# Altium schematic sheet Buttons and Switches.SchDoc
size B
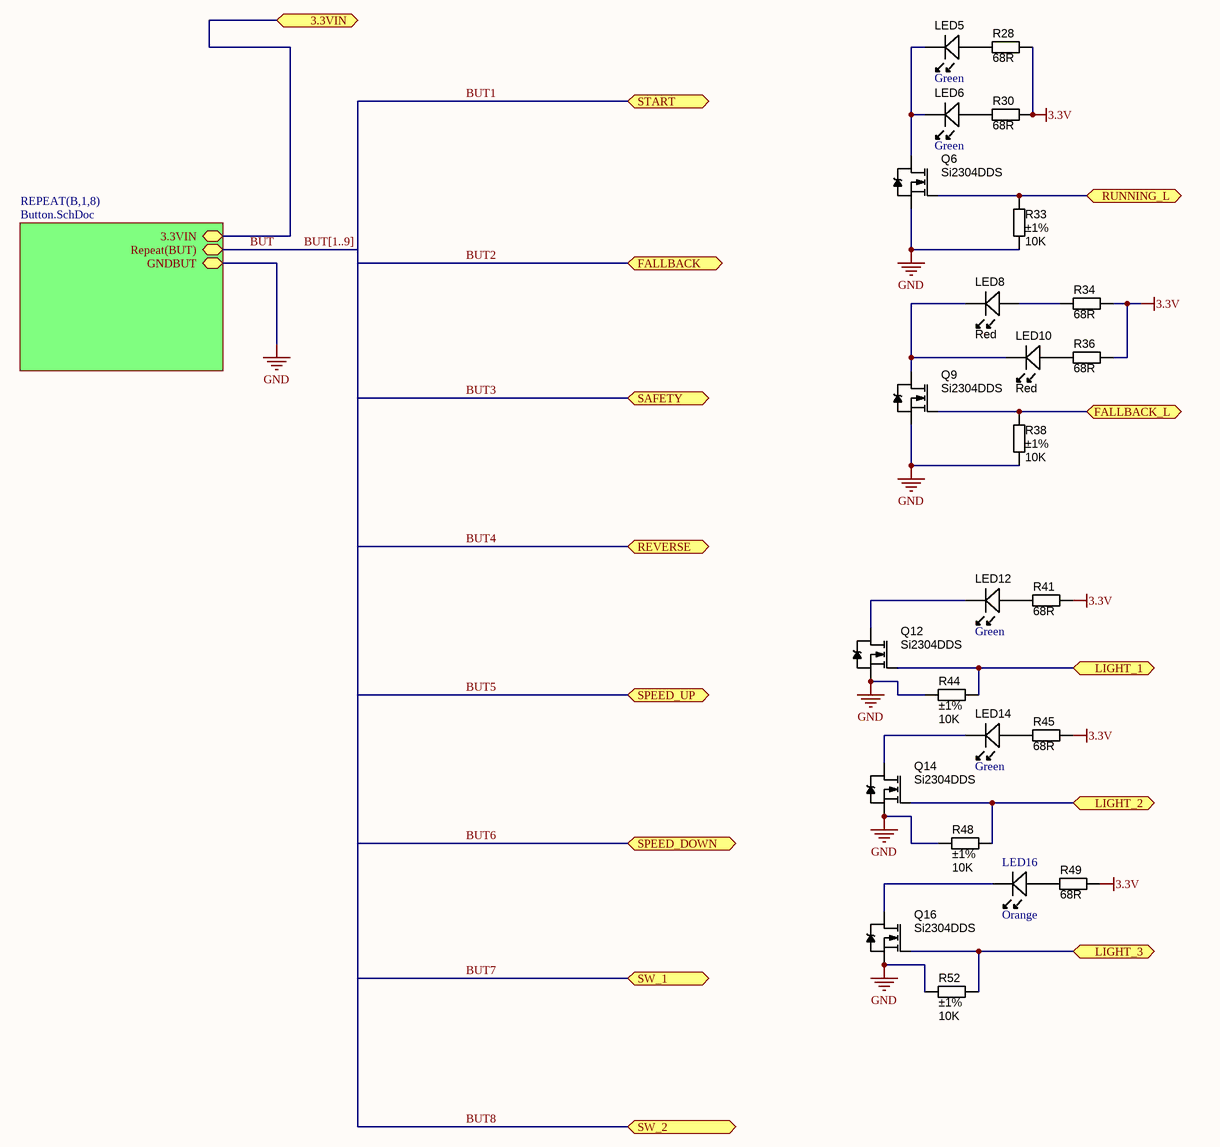
[diagram p0: Buttons and Switches.SchDoc]

## Parts
LED5  Color: Green  [LED-0603-GREEN]  (hidden comment: APT1608CGCK)
LED6  Color: Green  [LED-0603-GREEN]  (hidden comment: APT1608CGCK)
LED8  Red  [LED-0603-RED]
LED10  Red  [LED-0603-RED]
LED12  Color: Green  [LED-0603-GREEN]  (hidden comment: APT1608CGCK)
LED14  Color: Green  [LED-0603-GREEN]  (hidden comment: APT1608CGCK)
LED16  Color: Orange  [LED-0603-AMBER]  (hidden comment: LO L296-Q2S1-24-Z)
Q6  Si2304DDS  [SOT23-3]
Q9  Si2304DDS  [SOT23-3]
Q12  Si2304DDS  [SOT23-3]
Q14  Si2304DDS  [SOT23-3]
Q16  Si2304DDS  [SOT23-3]
R28  value 68R  [RESC1608X55N]  (hidden comment: Thick Film)
R30  value 68R  [RESC1608X55N]  (hidden comment: Thick Film)
R33  value 10K  Tolerance: ±1%  [RESC1005X40N]  (hidden comment: Thick Film)
R34  value 68R  [RESC1608X55N]  (hidden comment: Thick Film)
R36  value 68R  [RESC1608X55N]  (hidden comment: Thick Film)
R38  value 10K  Tolerance: ±1%  [RESC1005X40N]  (hidden comment: Thick Film)
R41  value 68R  [RESC1608X55N]  (hidden comment: Thick Film)
R44  value 10K  Tolerance: ±1%  [RESC1005X40N]  (hidden comment: Thick Film)
R45  value 68R  [RESC1608X55N]  (hidden comment: Thick Film)
R48  value 10K  Tolerance: ±1%  [RESC1005X40N]  (hidden comment: Thick Film)
R49  value 68R  [RESC1608X55N]  (hidden comment: Thick Film)
R52  value 10K  Tolerance: ±1%  [RESC1005X40N]  (hidden comment: Thick Film)

## Sub-sheets
REPEAT(B,1,8) = Button.SchDoc: 3.3VIN, Repeat(BUT), GNDBUT

## Ports
3.3VIN, FALLBACK, FALLBACK_L, LIGHT_1, LIGHT_2, LIGHT_3, REVERSE, RUNNING_L, SAFETY, SPEED_DOWN, SPEED_UP, START, SW_1, SW_2

## Nets
3.3V: R28.1 R30.1 R34.1 R36.1 R41.1 R45.1 R49.1
GND: Q6.2(S) Q9.2(S) Q12.2(S) Q14.2(S) Q16.2(S) R33.2 R38.2 R44.1 R48.1 R52.1 ; sheet REPEAT(B,1,8)/GNDBUT
3.3VIN: port 3.3VIN, sheet REPEAT(B,1,8)/3.3VIN
BUT: sheet REPEAT(B,1,8)/Repeat(BUT)
BUT1: port START
BUT2: port FALLBACK
BUT3: port SAFETY
BUT4: port REVERSE
BUT5: port SPEED_UP
BUT6: port SPEED_DOWN
BUT7: port SW_1
BUT8: port SW_2
FALLBACK_L: Q9.1(G) R38.1 ; port FALLBACK_L
LIGHT_1: Q12.1(G) R44.2 ; port LIGHT_1
LIGHT_2: Q14.1(G) R48.2 ; port LIGHT_2
LIGHT_3: Q16.1(G) R52.2 ; port LIGHT_3
RUNNING_L: Q6.1(G) R33.1 ; port RUNNING_L
NetLED5_A: LED5.A R28.2
NetLED5_K: LED5.K LED6.K Q6.3(D)
NetLED6_A: LED6.A R30.2
NetLED8_A: LED8.A R34.2
NetLED8_K: LED8.K LED10.K Q9.3(D)
NetLED10_A: LED10.A R36.2
NetLED12_A: LED12.A R41.2
NetLED12_K: LED12.K Q12.3(D)
NetLED14_A: LED14.A R45.2
NetLED14_K: LED14.K Q14.3(D)
NetLED16_A: LED16.A R49.2
NetLED16_K: LED16.K Q16.3(D)

## Buses and harness runs
bus BUT[1..9]

## Library data of the parts
LED5 LED6 LED12 LED14 = LED_SMD_Green_0603_50mcd: Green 570nm LED Indication - Discrete 2.1V 0603 (1608 Metric); Manufacturer: Kingbright; Lens Color: Colorless; Lens Transparency: Clear; Millicandela Rating: 50mcd; Lens Style/Size: Rectangle with Flat Top, 1.20mm x 0.80mm; Current - Test: 20mA; Viewing Angle: 120°; Wavelength - Peak: 574nm; Supplier 1: Digi-Key; Supplier Part Number 1: 754-1116-1-ND; Manufacturer Part Number: APT1608CGCK; Packaging: Cut Tape (CT); Part Status: Active; Voltage - Forward (Vf) (Typ): 2.1V; Mounting Type: Surface Mount; Wavelength - Dominant: 570nm; Features: -; Package / Case: 0603 (1608 Metric); Supplier Device Package: Chip LED; Size / Dimension: 1.60mm L x 0.80mm W; Height (Max): 0.75mm; ComponentLink1URL: http://www.kingbrightusa.com/images/catalog/SPEC/APT1608CGCK.pdf; ComponentLink1Description: http://www.kingbrightusa.com/images/catalog/SPEC/APT1608CGCK.pdf; RoHS: RoHS Compliant; Category: Optoelectronics; Stock 1: 896844; Pricing 1: 1=0.47, 10=0.337, 25=0.258, 100=0.1683, 250=0.12344, 500=0.10472, 1000=0.08602 (USD)
LED8 LED10 = LED_SMD_Red_0603_220mcd: LED 0603 SMD Hyper Red 630nm 220mcd 20mA; Manufacturer 1: Kingbright Company LLC; Manufacturer Part Number 1: APT1608SURCK; Material: AlGaInP on GaAs; Ratings: 220 mcd; 630 nm; Voltage - Forward (Vf) Typ: 1.95V; Voltage - Forward (Vf) @ 10mA: 1.9V; SCDType: source; Package / Case: 0603 (1608 metric); Supplier 1: Digi-Key; Supplier Part Number 1: 754-1123-1-ND; ComponentLink1URL: http://www.us.kingbright.com/images/catalog/SPEC/APT1608SURCK.pdf; ComponentLink1Description: http://www.us.kingbright.com/images/catalog/SPEC/APT1608SURCK.pdf
LED16 = LED_0603_Orange: LED ORANGE DIFFUSED 0603 SMD; Manufacturer: OSRAM Opto Semiconductors Inc.; Lens Color: White; Millicandela Rating: 157mcd; Lens Style/Size: Rectangle with Flat Top, 1.30mm x 0.80mm; Voltage - Forward (Vf) (Typ): 2V; Current - Test: 20mA; Viewing Angle: 160°; Wavelength - Dominant: 605nm; Supplier 1: Digi-Key; Manufacturer Part Number: LO L296-Q2S1-24-Z; Packaging: Cut Tape (CT); Part Status: Active; Lens Transparency: Diffused; Mounting Type: Surface Mount; Wavelength - Peak: -; Features: -; Package / Case: 0603 (1608 Metric); Size / Dimension: 1.70mm L x 0.80mm W; Height (Max): 0.65mm; ComponentLink1URL: http://www.osram-os.com/Graphics/XPic9/00077122_0.pdf; ComponentLink1Description: http://www.osram-os.com/Graphics/XPic9/00077122_0.pdf; Supplier Part Number 1: 475-2739-1-ND; RoHS: RoHS Compliant; Category: Optoelectronics; Stock 1: 4435; Pricing 1: 1=0.34, 10=0.245, 25=0.2004, 100=0.1603, 250=0.13524, 500=0.11522, 1000=0.09017, 2500=0.08349 (USD)
Q6 Q9 Q12 Q14 Q16 = MOSFET_Si2304DDS: MOSFET SMD N-CH 30V 3.6A 1.7W SOT23-3; Material: Metal Oxide; SCDType: source; Ratings: 30V; 3.6A; Package / Case: SOT23-3; Supplier 1: Digi-Key; Supplier Part Number 1: SI2304DDS-T1-GE3CT-ND
R28 R30 R34 R36 R41 R45 R49 = RES_68R_0603_5%: Resistor SMD chip 68 Ohm 0.1W 5% 0603; Manufacturer 1: Yageo; Manufacturer Part Number 1: RC0603JR-0768RL; Ratings: 1/10 W; SCDType: spec; Package / Case: 0603 (1608 metric); Tolerance: ±5%; Material: Thick Film; Supplier 1: Digi-Key; Supplier Part Number 1: 311-68GRCT-ND
R33 R38 R44 R48 R52 = RES_10K_0402_1%: Resistor SMD chip 10k Ohm 0.063W 1% 0402; Manufacturer 1: Vishay Dale; Manufacturer Part Number 1: CRCW040210K0FKED; Ratings: 1/16 W; SCDType: spec; Package / Case: 0402 (1005 Metric); Manufacturer 2: Yageo; Manufacturer Part Number 2: RC0402FR-0710KL; Supplier 1: Digi-Key; Supplier Part Number 1: 541-10.0KLCT-ND; ComponentLink1URL: http://www.vishay.com/doc?20035; ComponentLink1Description: http://www.vishay.com/doc?20035; Supplier 2: Digi-Key; Supplier Part Number 2: 311-10.0KLRCT-ND; ComponentLink2URL: http://www.yageo.com/documents/recent/PYu-RC0402_51_RoHS_L_6.pdf; ComponentLink2Description: http://www.yageo.com/documents/recent/PYu-RC0402_51_RoHS_L_6.pdf